# EAGLE design SLUGSservobreakout (EAGLE 6.2)
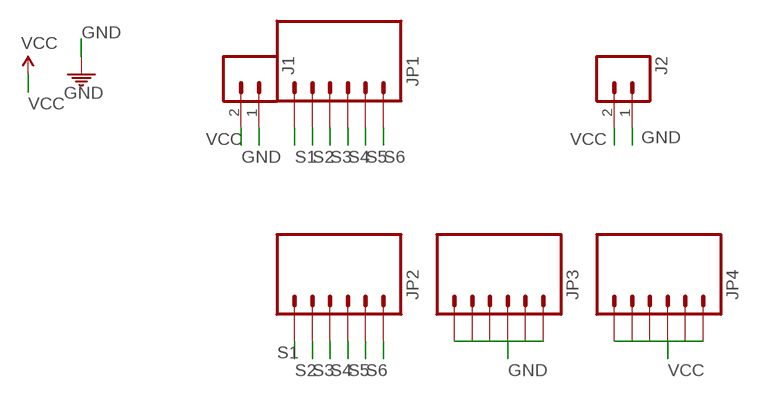
[diagram p0: schematic, sheet 1]

## Parts
J1  M02PTH  [1X02]
J2  M02PTH  [1X02]
JP1  M06SIP  [1X06]
JP2  M06SIP  [1X06]
JP3  M06SIP  [1X06]
JP4  M06SIP  [1X06]

## Nets
GND: J1.1 J2.1 JP3.1 JP3.2 JP3.3 JP3.4 JP3.5 JP3.6
S1: JP1.6 JP2.6
S2: JP1.5 JP2.5
S3: JP1.4 JP2.4
S4: JP1.3 JP2.3
S5: JP1.2 JP2.2
S6: JP1.1 JP2.1
VCC: J1.2 J2.2 JP4.1 JP4.2 JP4.3 JP4.4 JP4.5 JP4.6

## Library data of the parts
J1 J2 = ASL:M02: Header 2 Standard 2-pin 0.1" header. Use with straight break away headers (SKU : PRT-00116), right angle break away headers (PRT-00553), swiss pins (PRT-00743), machine pins (PRT-00117), and female headers (PRT-00115). Molex polarized connector foot print use with SKU : PRT-08233 with associated crimp pins and housings.
JP1-JP4 = ASL:M06: Header 6 Standard 6-pin 0.1" header. Use with straight break away headers (SKU : PRT-00116), right angle break away headers (PRT-00553), swiss pins (PRT-00743), machine pins (PRT-00117), and female headers (PRT-00115). Molex polarized connector foot print use with SKU : PRT-08094 with associated crimp pins and housings. NOTES ON THE VARIANTS LOCK and LOCK_LONGPADS... This footprint was designed to help hold the alignment of a through-hole component (i.e. 6-pin header) while soldering it into place. You may notice that each hole has been shifted either up or down by 0.005 of an inch from it's more standard position (which is a perfectly straight line). This slight alteration caused the pins (the squares in the middle) to touch the edges of the holes. Because they are alternating, it causes a "brace" to hold the component in place. 0.005 has proven to be the perfect amount of "off-center" position when using our standard breakaway headers. Although looks a little odd when you look at the bare footprint, once you have a header in there, the alteration is very hard to notice. Also, if you push a header all the way into place, it is covered up entirely on the bottom side. This idea of altering the position of holes to aid alignment will be further integrated into the Sparkfun Library for other footprints. It can help hold any component with 3 or more connection pins.

## Board
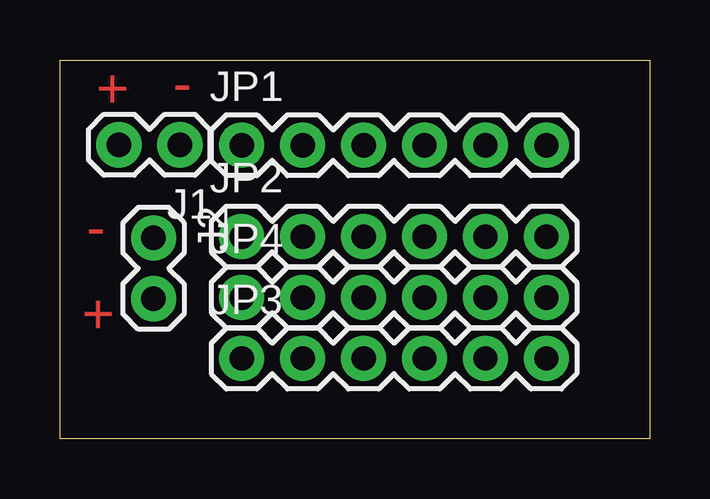
[diagram p1: board, top side]
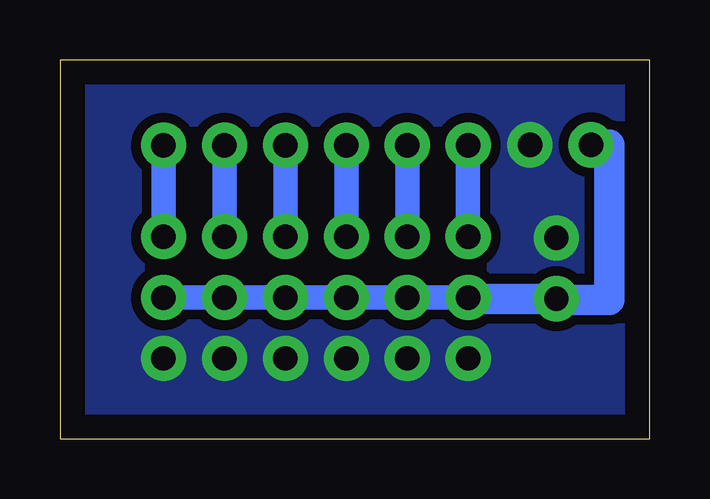
[diagram p2: board, bottom side, seen from below]

Size 24.6 x 15.8 mm. Coordinates in mm from the lower left corner, seen from the top.
Outline: 0,15.8 24.6,15.8 24.6,0 0,0 0,15.8
Copper layers (1*16): Top 0.035mm / dielectric 1.5mm / Bottom 0.035mm
Design rules: minimum track width 10mil, minimum drill 24mil, track to track 8mil, track to pad 8mil, pad to pad 8mil, via to via 8mil, smd to smd 8mil, copper to edge 40mil, drill to drill 8mil, minimum pad ring 10mil, minimum via ring 8mil, stop-mask expansion 4mil, vias tented up to drill 0mil, thermal gap 10mil

### Footprints (pad centres in the part's own frame; a part is rotated, then mirrored left to right if it is on the bottom)
1X02 = drill 1.016 pad 1.88: 1 0,0; 2 2.54,0
1X06 = drill 1.016 pad 1.88: 1 -6.35,0; 2 -3.81,0; 3 -1.27,0; 4 1.27,0; 5 3.81,0; 6 6.35,0

### Placement (x,y rotation side)
J1  5,12.26 180 top
J2  3.9,8.38 270 top
JP1  13.93,12.24 0 top
JP2  13.93,8.43 0 top
JP3  13.93,3.35 0 top
JP4  13.93,5.89 0 top

### Tracks (layer width: path | path; a pad name or v marks a point on that pad's centre or on a via)
GND
  pour Bottom (isolate 0.406, no thermals): 0.8,15 23.8,15 23.8,1 0.8,1
S1
  Bottom 1.016: JP1.6 JP2.6
S2
  Bottom 1.016: JP1.5 JP2.5
S3
  Bottom 1.016: JP1.4 JP2.4
S4
  Bottom 1.016: JP1.3 JP2.3
S5
  Bottom 1.016: JP1.2 JP2.2
S6
  Bottom 1.016: JP1.1 JP2.1
VCC
  Bottom 1.016: JP4.1 JP4.2 JP4.3 JP4.4 JP4.5 JP4.6
  Bottom 1.27: J1.2 1.7,12.26 1.7,5.8 3.9,5.8 J2.2 7.58,5.84 JP4.1

### Text on the board
Top: + | - | - | +